# Altium schematic sheet UKU100P.SCHDOC
size A3
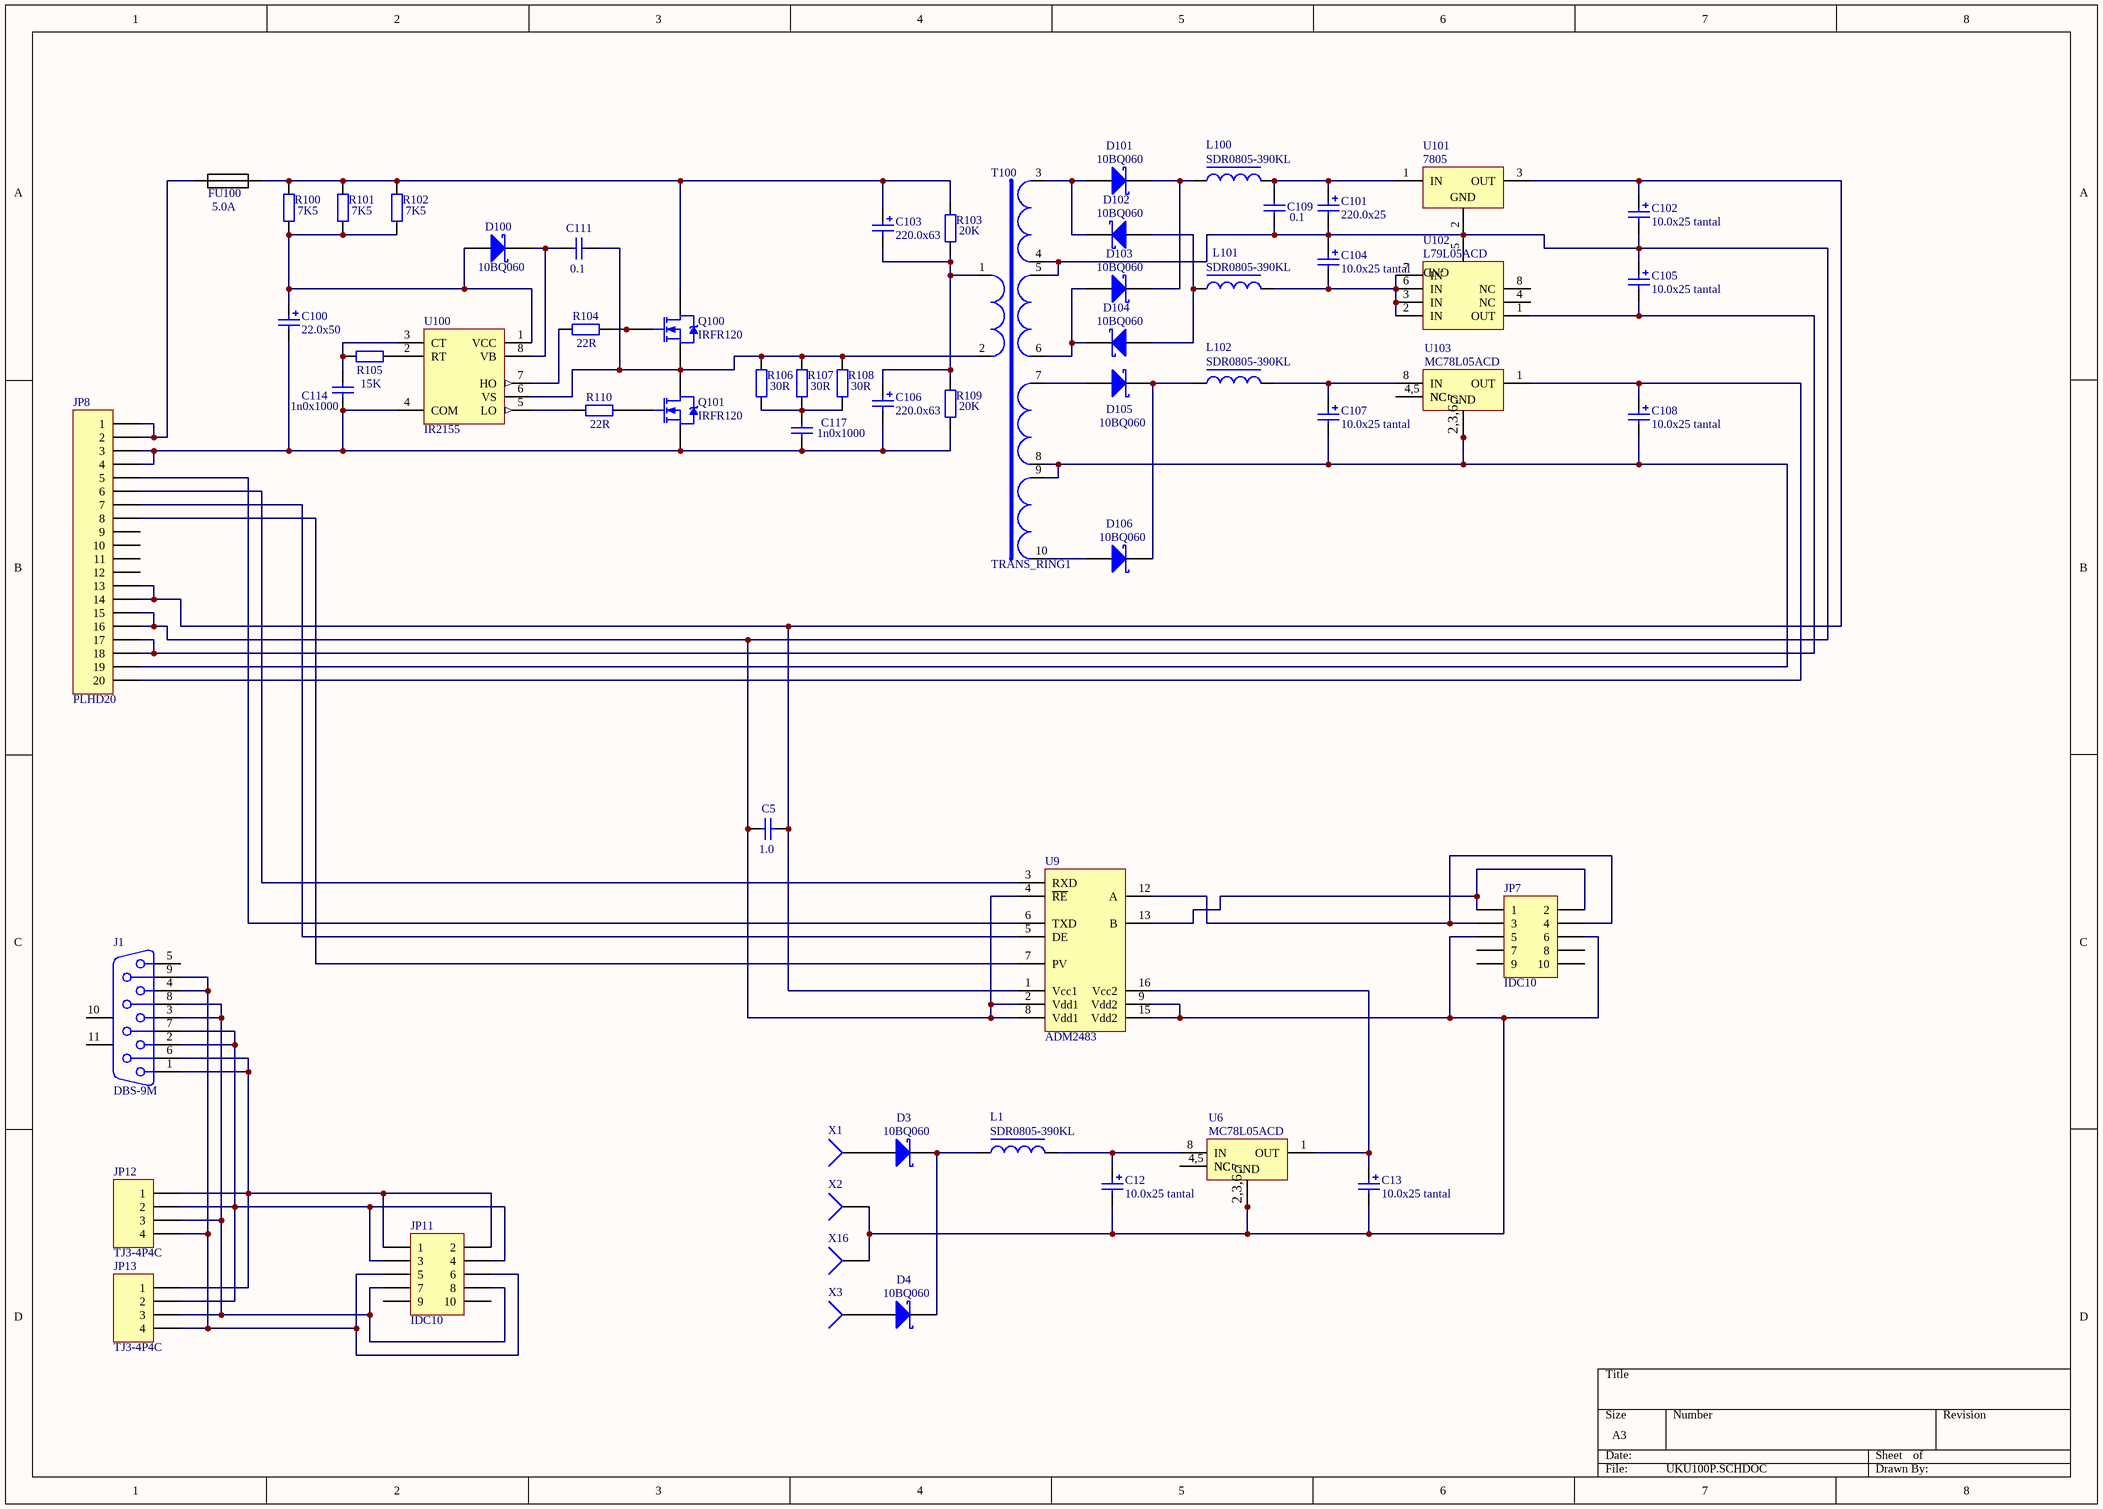
[diagram p0: UKU100P.SCHDOC]

## Parts
C5  1.0  [C3216-1206]
C12  10.0x25 tantal  [CAP_EL_6_3]
C13  10.0x25 tantal  [CAP_EL_6_3]
C100  22.0x50  [el3]
C101  220.0x25  [el5]
C102  10.0x25 tantal  [CAP_EL_6_3]
C103  220.0x63  [el5]
C104  10.0x25 tantal  [CAP_EL_6_3]
C105  10.0x25 tantal  [CAP_EL_6_3]
C106  220.0x63  [el5]
C107  10.0x25 tantal  [CAP_EL_6_3]
C108  10.0x25 tantal  [CAP_EL_6_3]
C109  0.1  [C3216-1206]
C111  0.1  [C3216-1206]
C114  1n0x1000  [C3216-1206]
C117  1n0x1000  [C3216-1206]
D3  10BQ060  [DSO-C2/X2.3]
D4  10BQ060  [DSO-C2/X2.3]
D100  10BQ060  [DSO-C2/X2.3]
D101  10BQ060  [D_6_3]
D102  10BQ060  [D_6_3]
D103  10BQ060  [D_6_3]
D104  10BQ060  [D_6_3]
D105  10BQ060  [DSO-C2/X2.3]
D106  10BQ060  [DSO-C2/X2.3]
FU100  5.0A  [FUSE2]
J1  DBS-9M  [DSUB_N9]
JP7  IDC10  [HDR2X5]
JP8  PLHD20  [HDR2X10]
JP11  IDC10  [HDR2X5]
JP12  TJ3-4P4C  [tj3-4p4c]
JP13  TJ3-4P4C  [tj3-4p4c]
L1  SDR0805-390KL  [L10x10]
L100  SDR0805-390KL  [L10x10]
L101  SDR0805-390KL  [L10x10]
L102  SDR0805-390KL  [L10x10]
Q100  IRFR120  [SIP-G3/E8]
Q101  IRFR120  [SIP-G3/E8]
R100  7K5  [_1206]
R101  7K5  [_1206]
R102  7K5  [_1206]
R103  20K  [_1206]
R104  22R  [_1206]
R105  15K  [_1206]
R106  30R  [_1206]
R107  30R  [_1206]
R108  30R  [_1206]
R109  20K  [_1206]
R110  22R  [_1206]
T100  TRANS_RING1  [trans_ring1]
U6  MC78L05ACD  [SO-G8]
U9  ADM2483  [SO-G16/D10.4]
U100  IR2155  [DIP-8/D11]
U101  7805  [7805_1]
U102  L79L05ACD  [SO-G8]
U103  MC78L05ACD  [SO-G8]
X1  (no value)  [PIN1]
X2  (no value)  [PIN1]
X3  (no value)  [PIN1]
X16  (no value)  [PIN1]

## Nets
NetC5_1: C5.1 C102.1 JP8.13 JP8.14 U9.1(Vcc1) U101.3(OUT)
NetC5_2: C5.2 C101.2 C102.2 C104.1 C105.1 C109.1 JP8.15 JP8.16 T100.4(Vss) T100.5(Vss) U9.2(Vdd1) U9.4(~{RE}) U9.8(Vdd1) U101.2(GND) U102.5(GND)
NetC12_1: C12.1 L1.2 U6.8(IN)
NetC12_2: C12.2 C13.2 JP7.5 JP7.6 U6.2(GND) U6.3(GND) U6.6(GND) U6.7(GND) U9.9(Vdd2) U9.15(Vdd2) X2.1 X16.1
NetC13_1: C13.1 U6.1(OUT) U9.16(Vcc2)
NetC100_1: C100.1 D100.1(A) R100.2 R101.2 R102.2 U100.1(VCC)
NetC100_2: C100.2 C106.2 C114.2 C117.2 JP8.3 JP8.4 Q101.3(S) R109.2 U100.4(COM)
NetC101_1: C101.1 C109.2 L100.2 U101.1(IN)
NetC103_1: C103.1 FU100.2 Q100.4(D) R100.1 R101.1 R102.1 R103.1
NetC103_2: C103.2 C106.1 R103.2 R109.1 T100.1(Vss)
NetC104_2: C104.2 L101.2 U102.2(IN) U102.3(IN) U102.6(IN) U102.7(IN)
NetC105_2: C105.2 JP8.17 JP8.18 U102.1(OUT)
NetC107_1: C107.1 L102.2 U103.8(IN)
NetC107_2: C107.2 C108.2 JP8.19 T100.8(Vss) T100.9(Vss) U103.2(GND) U103.3(GND) U103.6(GND) U103.7(GND)
NetC108_1: C108.1 JP8.20 U103.1(OUT)
NetC111_1: C111.1 D100.2(K) U100.8(VB)
NetC111_2: C111.2 Q100.3(S) Q101.4(D) R106.1 R107.1 R108.1 T100.2(Vss) U100.6(VS)
NetC114_1: C114.1 R105.1 U100.3(CT)
NetC117_1: C117.1 R106.2 R107.2 R108.2
NetD3_1: D3.1(A) X1.1
NetD3_2: D3.2(K) D4.2(K) L1.1
NetD4_1: D4.1(A) X3.1
NetD101_1: D101.1(A) D102.2(K) T100.3(Vss)
NetD101_2: D101.2(K) D103.2(K) L100.1
NetD102_1: D102.1(A) D104.1(A) L101.1
NetD103_1: D103.1(A) D104.2(K) T100.6(Vss)
NetD105_1: D105.1(A) T100.7(Vss)
NetD105_2: D105.2(K) D106.2(K) L102.1
NetD106_1: D106.1(A) T100.10(Vss)
NetFU100_1: FU100.1 JP8.1 JP8.2
NetJ1_1: J1.1 J1.6 JP11.1 JP11.2 JP12.1 JP13.1
NetJ1_2: J1.2 J1.7 JP11.3 JP11.4 JP12.2 JP13.2
NetJ1_3: J1.3 J1.8 JP11.7 JP11.8 JP12.3 JP13.3
NetJ1_4: J1.4 J1.9 JP11.5 JP11.6 JP12.4 JP13.4
NetJP7_1: JP7.1 JP7.2 U9.13(B)
NetJP7_3: JP7.3 JP7.4 U9.12(A)
NetJP8_5: JP8.5 U9.6(TXD)
NetJP8_6: JP8.6 U9.3(RXD)
NetJP8_7: JP8.7 U9.5(DE)
NetJP8_8: JP8.8 U9.7(PV)
NetQ100_1: Q100.1(G) R104.2
NetQ101_1: Q101.1(G) R110.2
NetR104_1: R104.1 U100.7(HO)
NetR105_2: R105.2 U100.2(RT)
NetR110_1: R110.1 U100.5(LO)
NetU6_4: U6.4(NC) U6.5(NC)
NetU103_4: U103.4(NC) U103.5(NC)

Not connected (* = marked no-connect by the designer): J1 5 10(MH1) 11(MH2); JP7 7 8 9 10; JP8 9 10 11 12; JP11 9 10; U102 4(NC) 8(NC)

## Notes on the sheet
- (in symbol MC78L05ACD) 4,5; 2,3,6,7

## Library data of the parts
C5 = Cap Semi: Capacitor (Semiconductor SIM Model); Manufacturer: Generic Components; Class I: Passive; Value: 1,0; Published: 8-Jun-2000; Revision: July-2002: Re-released for DXP Platform.; Publisher: Altium Limited; Class II: Capacitor
C12 C13 C102 C104 C105 C107 C108 = Cap Pol1: Polarized Capacitor (Radial); Manufacturer: Generic Components; Class I: Passive; Value: 10,0x25; Published: 8-Jun-2000; Revision: July-2002: Re-released for DXP Platform.; Publisher: Altium Limited; Class II: Capacitor
C100 = Cap Pol1: Polarized Capacitor (Radial); Manufacturer: Generic Components; Class I: Passive; Value: 22,0x50; Published: 8-Jun-2000; Revision: July-2002: Re-released for DXP Platform.; Publisher: Altium Limited; Class II: Capacitor
C101 = Cap Pol1: Polarized Capacitor (Radial); Manufacturer: Generic Components; Class I: Passive; Value: 220,0x25; Published: 8-Jun-2000; Revision: July-2002: Re-released for DXP Platform.; Publisher: Altium Limited; Class II: Capacitor
C103 C106 = Cap Pol1: Polarized Capacitor (Radial); Manufacturer: Generic Components; Class I: Passive; Value: 220,0x63; Published: 8-Jun-2000; Revision: July-2002: Re-released for DXP Platform.; Publisher: Altium Limited; Class II: Capacitor
C109 C111 = Cap Semi: Capacitor (Semiconductor SIM Model); Manufacturer: Generic Components; Class I: Passive; Value: 0,1; Published: 8-Jun-2000; Revision: July-2002: Re-released for DXP Platform.; Publisher: Altium Limited; Class II: Capacitor
C114 C117 = Cap Semi: Capacitor (Semiconductor SIM Model); Manufacturer: Generic Components; Class I: Passive; Value: 1000; Published: 8-Jun-2000; Revision: July-2002: Re-released for DXP Platform.; Publisher: Altium Limited; Class II: Capacitor
D3 D4 D100-D106 = 10BQ015: Schottky Rectifier; Manufacturer: International Rectifier; Revision 1: 10-July-2000: SIM Model Added.; Revision 2: July-2002: Re-released for DXP Platform.; Class I: Discrete; Class II: Rectifier - Schottky; Published: 8-Jun-2000; Datasheet: Latest Revision: PD-2.396A; Package Reference: DO-214AA; Publisher: Altium Limited
FU100 = FUSE
J1 = D Connector 9: Receptacle Assembly, 9 Position, Right Angle; Manufacturer: Generic Components; Package Information: Latest Revision: O; Positions: 9; Published: 15-Jun-2001; Revision: July-2002: Re-released for DXP Platform.; Datasheet: (1-Sep-1999); Package Reference: 788750; Publisher: Altium Limited; Class I: Connector; Orientation: Right Angle; Gender: Receptacle
JP7 JP11 = Header 5X2: Header, 5-Pin, Dual row; Manufacturer: Generic Components; Class I: Connector; Revision: July-2002: Re-released for DXP Platform.; Publisher: Altium Limited
JP8 = Header 20: Header, 20-Pin; Manufacturer: Generic Components; Class I: Connector; Revision: July-2002: Re-released for DXP Platform.; Publisher: Altium Limited
JP12 JP13 = Header 4: Header, 4-Pin; Manufacturer: Generic Components; Class I: Connector; Revision: July-2002: Re-released for DXP Platform.; Publisher: Altium Limited
L1 L100-L102 = Inductor Konstr 2: Magnetic-Core Inductor; Manufacturer: Generic Components; Class I: Passive; Published: 24-Mar-1999; Revision: July-2002: Re-released for DXP Platform.; Publisher: Altium Limited; Class II: Inductor
Q100 Q101 = IRFR120: HEXFET N-Channel Power MOSFET; Manufacturer: International Rectifier; Revision 1: 10-July-2000: SIM Model Added.; Revision 2: July-2002: Re-released for DXP Platform.; Class I: Discrete; Class II: MOSFET - Power; Note: Pin 2 is trimmed and is electrically connected to Drain.; Published: 8-Jun-2000; Datasheet: Latest Revision: PD-9.523D; Package Reference: TO-252AA; Publisher: Altium Limited
R100-R102 = Res2: Resistor; Manufacturer: Generic Components; Class I: Passive; Value: 33K; Rule: Undefined; Published: 8-Jun-2000; Revision: July-2002: Re-released for DXP Platform.; Publisher: Altium Limited; Class II: Resistor
R103 R105 R109 = Res2: Resistor; Manufacturer: Generic Components; Class I: Passive; Rule: Undefined; Published: 8-Jun-2000; Revision: July-2002: Re-released for DXP Platform.; Publisher: Altium Limited; Class II: Resistor
  R103 R109: Value: 20K
  R105: Value: 15K
R104 R110 = Res2: Resistor; Manufacturer: Generic Components; Class I: Passive; Value: 22; Rule: Undefined; Published: 8-Jun-2000; Revision: July-2002: Re-released for DXP Platform.; Publisher: Altium Limited; Class II: Resistor
R106-R108 = Res2: Resistor; Manufacturer: Generic Components; Class I: Passive; Value: 30; Rule: Undefined; Published: 8-Jun-2000; Revision: July-2002: Re-released for DXP Platform.; Publisher: Altium Limited; Class II: Resistor
U6 U103 = MC78L05ACD: 3-Terminal Low-Current Positive Fixed Voltage Regulator; Manufacturer: Motorola; Class I: Power Management; Published: 15-Apr-2002; Datasheet: Linear and Interface Integrated Circuits, DL128 Rev2 (1988); Package Reference: 751-02; Publisher: Altium Limited; Class II: Voltage Regulator
U100 = IR2155: Self-Oscillating Half-Bridge Driver; Manufacturer: International Rectifier; Class I: Interface; Published: 8-Jun-2000; Revision: July-2002: Re-released for DXP Platform.; Datasheet: Latest Revision: PD60029I; Package Reference: PDIP8; Publisher: Altium Limited; Class II: Bridge Driver
U101 = 7805: 3-Terminal Positive Fixed Voltage Regulator; Manufacturer: Motorola; Class I: Power Management; Note: Pin 2 is electrically connected to TAB; Published: 15-Apr-2002; Datasheet: Linear and Interface Integrated Circuits, DL128 Rev2 (1988); Package Reference: 221A-04; Publisher: Altium Limited; Class II: Voltage Regulator
U102 = L79L05ACD: Negative Voltage Regulator; Manufacturer: ST-Microelectronics; Package Information: Latest Revision: Jul-1998; Class I: Power Management; Published: 24-Aug-2001; Revision: July-2002: Re-released for DXP Platform.; Datasheet: Latest Revision: Apr-1999; Package Reference: SO8; Publisher: Altium Limited; Class II: Voltage Regulator
X1-X3 X16 = Socket: Manufacturer: Generic Components; Class I: Connector; Revision: July-2002: Re-released for DXP Platform.; Publisher: Altium Limited